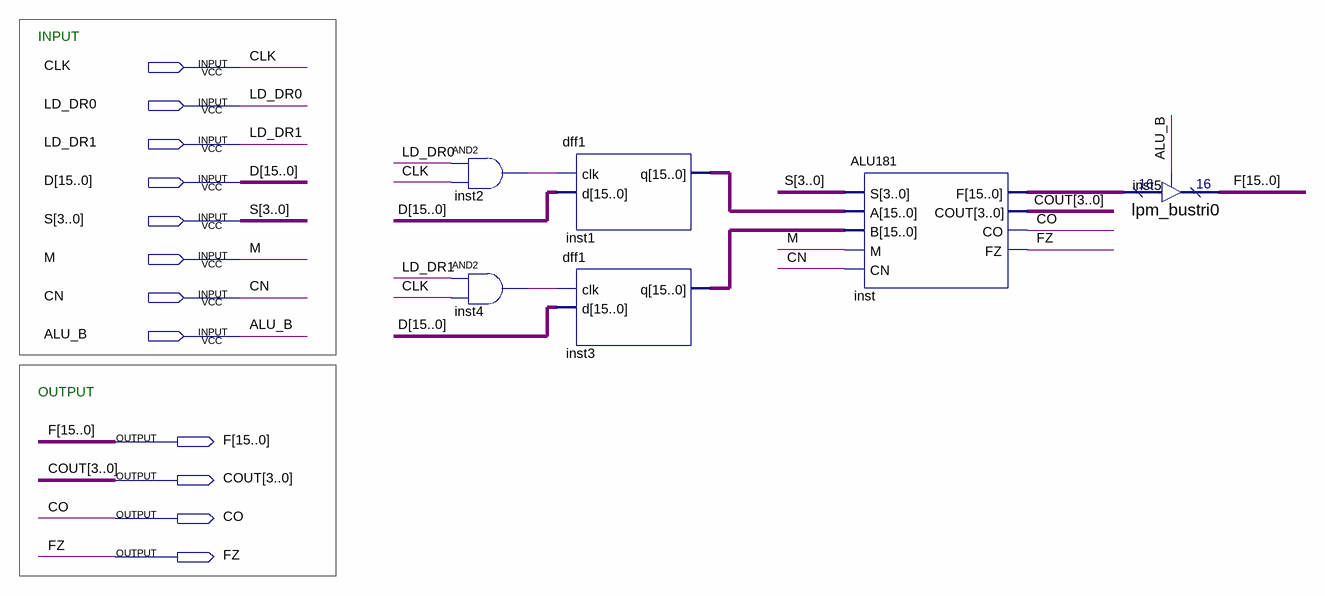
[diagram p0: schematic sheet]
// Quartus schematic alu.bdf as structural Verilog: 6 symbols, 12 pins
module alu (
  input  CLK,
  input  LD_DR0,
  input  LD_DR1,
  input  [15:0] D,
  input  [3:0] S,
  input  M,
  input  CN,
  input  ALU_B,
  output [15:0] F,
  output [3:0] COUT,
  output CO,
  output FZ
);

  wire inst2_out, inst4_out;
  wire [15:0] inst1_q, inst3_q, inst_f;

  and inst2 (inst2_out, LD_DR0, CLK);
  and inst4 (inst4_out, LD_DR1, CLK);
  dff1 inst1 (.clk(inst2_out), .d(D), .q(inst1_q));
  dff1 inst3 (.clk(inst4_out), .d(D), .q(inst3_q));
  ALU181 inst (.S(S), .A(inst1_q), .B(inst3_q), .M(M), .CN(CN), .F(inst_f), .COUT(COUT), .CO(CO), .FZ(FZ));
  lpm_bustri0 inst5 (.enabledt(ALU_B), .data(inst_f), .tridata(F));

  // Notes on the sheet:
  //   INPUT
  //   OUTPUT
endmodule
